# Altium schematic sheet SI5351.V03.R00.SchDoc: Reloj SI5351
size A4; SheetNumber: 9; SheetTotal: 18
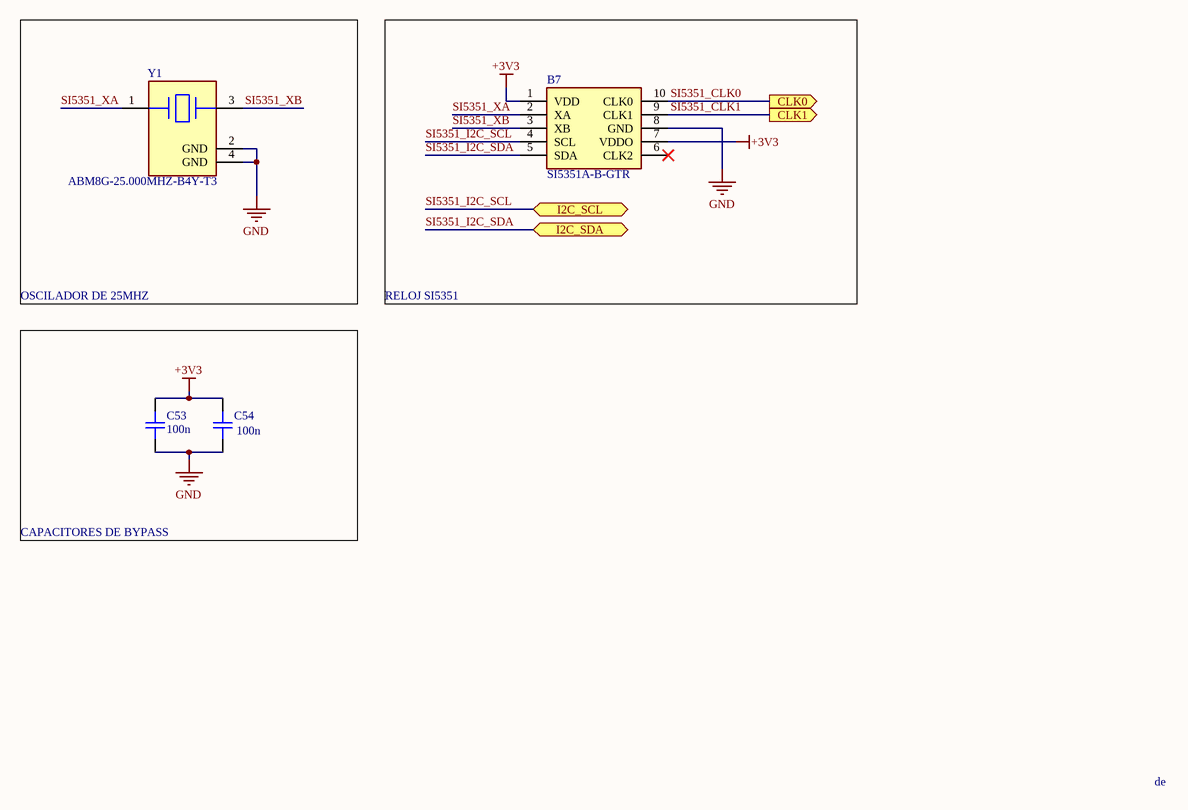
[diagram p0: SI5351.V03.R00.SchDoc]

## Parts
B7  SI5351A-B-GTR  [SOP50P490X110-10N]
C53  100n  [CAP_0805]
C54  100n  [CAP_0805]
Y1  ABM8G-25.000MHZ-B4Y-T3  [FP-ABM8G-MFG]

## Blocks framed on the sheet
OSCILADOR DE 25MHZ: Y1
RELOJ SI5351: B7
CAPACITORES DE BYPASS: C53 C54

## Ports
CLK0 (out), CLK1 (out), I2C_SCL (bidir), I2C_SDA (bidir)

## Nets
+3V3: B7.1(VDD) B7.7(VDDO) C53.2 C54.2
GND: B7.8(GND) C53.1 C54.1 Y1.2(GND) Y1.4(GND)
SI5351_CLK0: B7.10(CLK0) ; port CLK0
SI5351_CLK1: B7.9(CLK1) ; port CLK1
SI5351_I2C_SCL: B7.4(SCL) ; port I2C_SCL
SI5351_I2C_SDA: B7.5(SDA) ; port I2C_SDA
SI5351_XA: B7.2(XA) Y1.1
SI5351_XB: B7.3(XB) Y1.3

Not connected (* = marked no-connect by the designer): B7 6(CLK2)*

## Notes on the sheet
- de

## Library data of the parts
B7 = SI5351A-B-GTR: Clock Generator 10MHz to 100MHz-IN 160MHz-OUT 10-Pin MSOP T/R; Manufacturer_Name: Skyworks; Geometry.Height: 1.1mm; Mouser Part Number: 634-SI5351A-B-GTR; Mouser Price/Stock: https://www.mouser.co.uk/ProductDetail/Skyworks-Solutions-Inc/SI5351A-B-GTR?qs=p9T7GgSe1IEYql%252BRMAlVcw%3D%3D; Manufacturer_Part_Number: SI5351A-B-GTR; Datasheet Link: https://www.mouser.de/datasheet/2/472/Si5351_B-2507774.pdf
C53 C54 = CAP_0805: Capacitor SMD 0805; Manufacturer: *; Manufacturer Part Number: *; Distributor Link: *; LCSC: *; Rating: *; Dielectric: *
Y1 = CMP-27762-015306-1: Crystal 25MHz ±30ppm (Tol) ±30ppm (Stability) 10pF FUND 60Ω 4-Pin SMD T/R; ESR (Equivalent Series Resistance): 60R; Max Operating Temperature: 70°C; Packaging: Tape and Reel; Length: 0.126inch; Height: 0.039inch; Frequency Stability: 30ppm; Package Quantity: 3000; Width: 2.5mm; Number of Pins: 4; Case/Package: SMD/SMT; Mount: Surface Mount; Series: ABM8G; Load Capacitance: 10pF; Min Operating Temperature: -20°C; Termination: SMD/SMT; Frequency: 25MHz; Tolerance: 30ppm; Frequency Tolerance: 30ppm